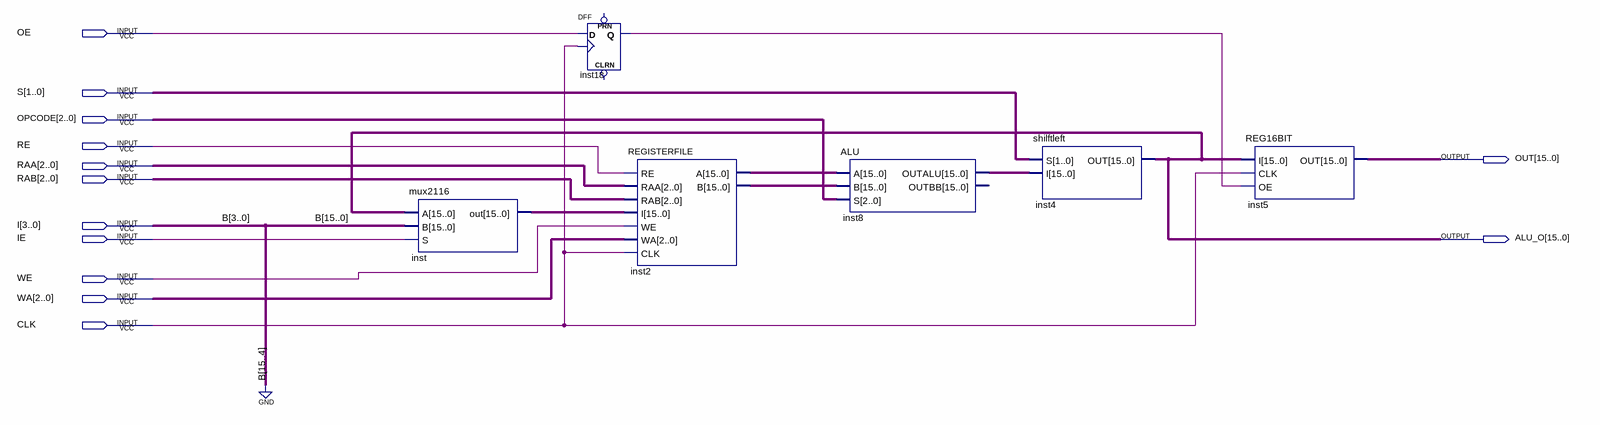
[diagram p0: schematic sheet]
// Quartus schematic Datapath.bdf as structural Verilog: 6 symbols, 13 pins
module Datapath (
  input  OE,
  input  [1:0] S,
  input  [2:0] OPCODE,
  input  RE,
  input  [2:0] RAA,
  input  [2:0] RAB,
  input  [3:0] I,
  input  IE,
  input  WE,
  input  [2:0] WA,
  input  CLK,
  output [15:0] OUT,
  output [15:0] ALU_O
);

  wire inst18_q;
  wire [15:0] inst2_a, inst2_b, inst8_outalu, inst_out;

  mux2116 inst (.A(ALU_O), .B({{12{1'b0}}, I}), .S(IE), .out(inst_out));
  DFF inst18 (.CLK(CLK), .D(OE), .Q(inst18_q));  // open: CLRN, PRN
  REGISTERFILE inst2 (
    .RE(RE), .RAA(RAA), .RAB(RAB), .I(inst_out), .WE(WE), .WA(WA), .CLK(CLK), .A(inst2_a), .B(inst2_b));
  ALU inst8 (.A(inst2_a), .B(inst2_b), .S(OPCODE), .OUTALU(inst8_outalu));  // open: OUTBB
  shilftleft inst4 (.S(S), .I(inst8_outalu), .OUT(ALU_O));
  REG16BIT inst5 (.I(ALU_O), .CLK(CLK), .OE(inst18_q), .OUT(OUT));

  // Other names for the same wires on the sheet: B[3:0] = I
endmodule
